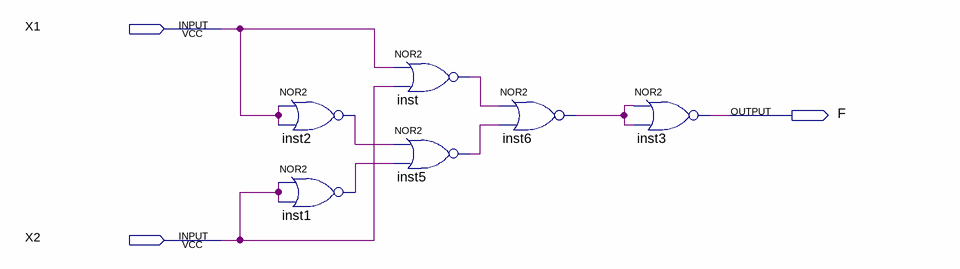
[diagram p0: schematic sheet]
// Quartus schematic lab_4.bdf as structural Verilog: 6 symbols, 3 pins
module lab_4 (
  input  X1,
  input  X2,
  output F
);

  wire inst1_out, inst2_out, inst5_out, inst6_out, inst_out;

  nor inst2 (inst2_out, X1, X1);
  nor inst1 (inst1_out, X2, X2);
  nor inst (inst_out, X1, X2);
  nor inst5 (inst5_out, inst2_out, inst1_out);
  nor inst6 (inst6_out, inst_out, inst5_out);
  nor inst3 (F, inst6_out, inst6_out);
endmodule
